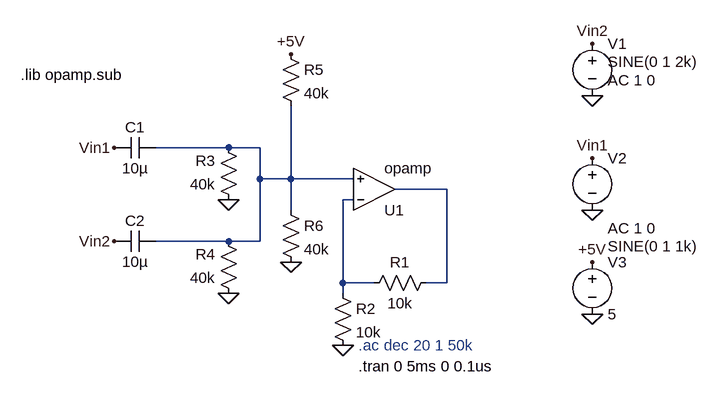
[diagram p0: schematic offset_alt.asc]
offset_alt.asc, the LTspice schematic file:
Version 4.1
SHEET 1 880 680
WIRE -16 48 -128 48
WIRE 32 48 -16 48
WIRE 32 96 32 48
WIRE 80 96 80 -16
WIRE 80 96 32 96
WIRE 176 96 80 96
WIRE 320 112 240 112
WIRE 176 128 160 128
WIRE 80 144 80 96
WIRE -16 192 -128 192
WIRE 32 192 32 96
WIRE 32 192 -16 192
WIRE 160 256 160 128
WIRE 208 256 160 256
WIRE 320 256 320 112
WIRE 320 256 288 256
WIRE 160 272 160 256
FLAG 80 224 0
FLAG -16 272 0
FLAG -16 128 0
FLAG 544 304 0
FLAG 544 144 0
FLAG 544 -32 0
FLAG 544 224 +5V
FLAG 80 -96 +5V
FLAG 544 64 Vin1
FLAG -192 48 Vin1
FLAG 544 -112 Vin2
FLAG -192 192 Vin2
FLAG 160 352 0
SYMBOL OpAmps\\opamp 208 176 M180
SYMATTR InstName U1
SYMBOL res 0 144 R180
WINDOW 0 36 76 Left 2
WINDOW 3 36 40 Left 2
SYMATTR InstName R3
SYMATTR Value 40k
SYMBOL res 0 288 R180
WINDOW 0 36 76 Left 2
WINDOW 3 36 40 Left 2
SYMATTR InstName R4
SYMATTR Value 40k
SYMBOL cap -128 32 R90
WINDOW 0 0 32 VBottom 2
WINDOW 3 32 32 VTop 2
SYMATTR InstName C1
SYMATTR Value 10µ
SYMBOL cap -128 176 R90
WINDOW 0 0 32 VBottom 2
WINDOW 3 32 32 VTop 2
SYMATTR InstName C2
SYMATTR Value 10µ
SYMBOL res 64 -112 R0
SYMATTR InstName R5
SYMATTR Value 40k
SYMBOL res 64 128 R0
SYMATTR InstName R6
SYMATTR Value 40k
SYMBOL voltage 544 -128 R0
WINDOW 3 24 44 Left 2
WINDOW 123 24 72 Left 2
WINDOW 39 0 0 Left 0
SYMATTR InstName V1
SYMATTR Value SINE(0 1 2k)
SYMATTR Value2 AC 1 0
SYMBOL voltage 544 48 R0
WINDOW 3 24 152 Left 2
WINDOW 123 24 124 Left 2
WINDOW 39 0 0 Left 0
SYMATTR InstName V2
SYMATTR Value SINE(0 1 1k)
SYMATTR Value2 AC 1 0
SYMBOL voltage 544 208 R0
WINDOW 123 0 0 Left 0
WINDOW 39 0 0 Left 0
SYMATTR InstName V3
SYMATTR Value 5
SYMBOL res 304 240 R90
WINDOW 0 0 56 VBottom 2
WINDOW 3 32 56 VTop 2
SYMATTR InstName R1
SYMATTR Value 10k
SYMBOL res 144 256 R0
SYMATTR InstName R2
SYMATTR Value 10k
TEXT -336 -64 Left 2 !.lib opamp.sub
TEXT 184 352 Left 2 ;.ac dec 20 1 50k
TEXT 184 384 Left 2 !.tran 0 5ms 0 0.1us

The netlist it stands for:
* offset_alt.asc
X§U1 N003 N001 N002 opamp Aol=100K GBW=10Meg  ; pins invin noninvin out
R3 0 N001 40k
R4 0 N001 40k
C1 N001 Vin1 10µ
C2 N001 Vin2 10µ
R5 +5V N001 40k
R6 N001 0 40k
V1 Vin2 0 SINE(0 1 2k) AC 1 0
V2 Vin1 0 SINE(0 1 1k) AC 1 0
V3 +5V 0 5
R1 N002 N003 10k
R2 N003 0 10k
.lib opamp.sub
* .ac dec 20 1 50k
.tran 0 5ms 0 0.1us
.backanno
.end